# Altium schematic sheet schematic.SchDoc
size A4
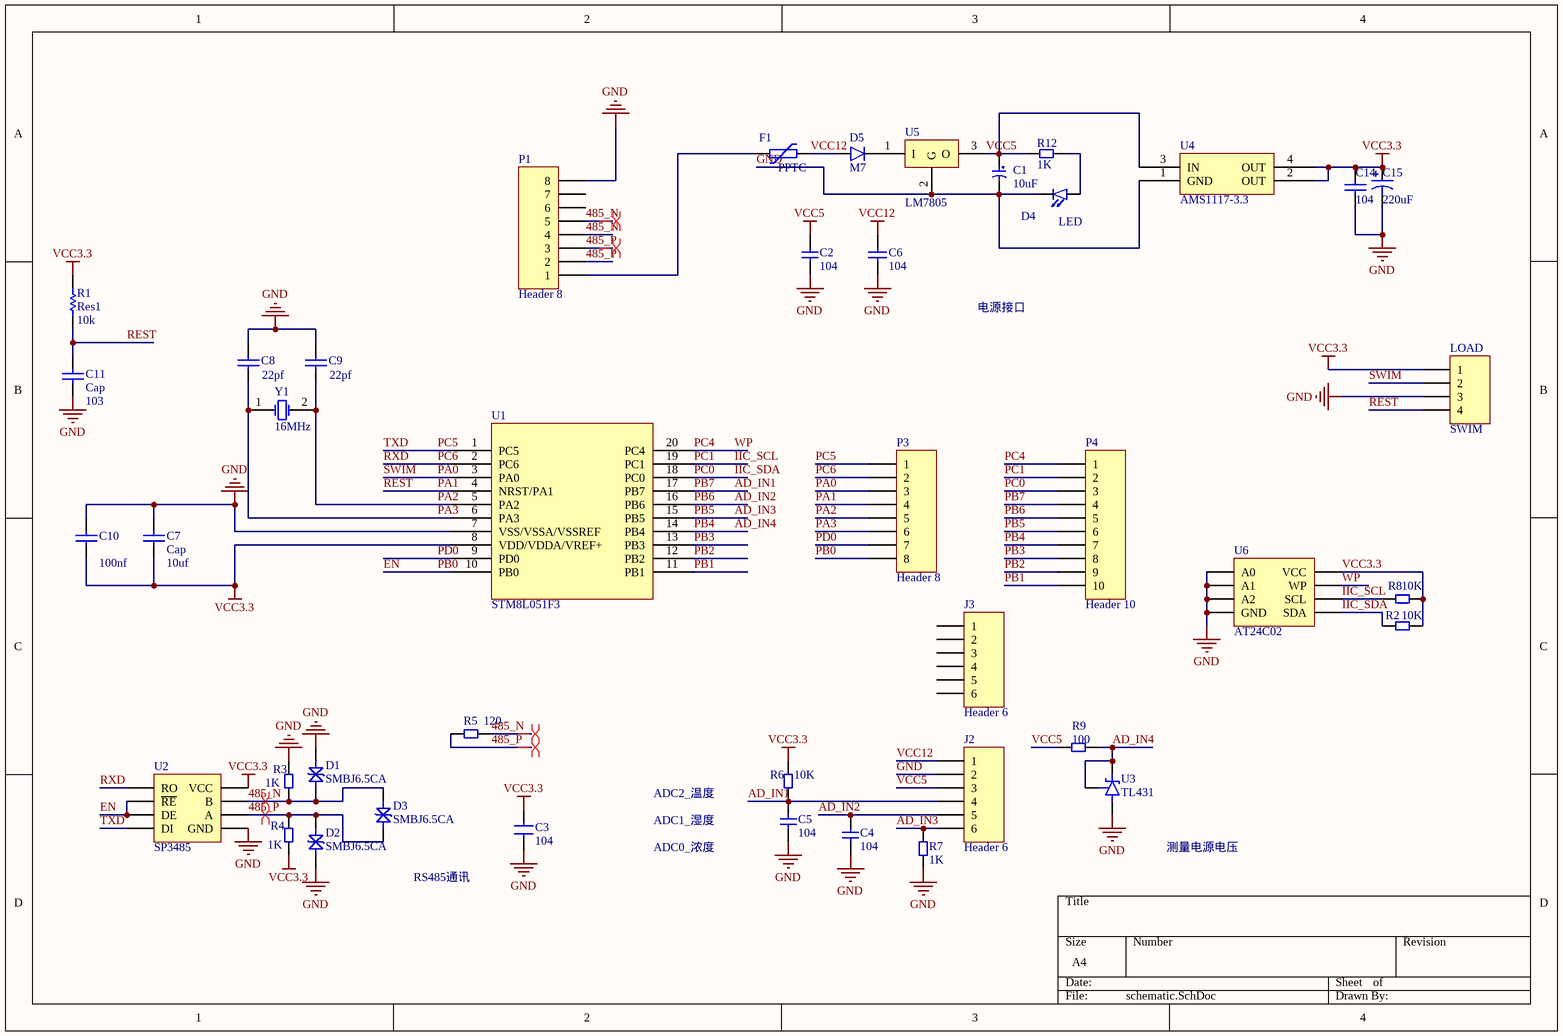
[diagram p0: schematic.SchDoc]

## Parts
C1  10uF  [1206-d]
C2  104  [0805]
C3  104  [0805]
C4  104  [0805]
C5  104  [0805]
C6  104  [0805C]
C7  Cap  value 10uf  [1206-D]
C8  value 22pf  [6-0805_N]  (hidden comment: Cap)
C9  value 22pf  [6-0805_N]  (hidden comment: Cap)
C10  value 100nf  [0805]  (hidden comment: Cap)
C11  Cap  value 103  [6-0805_N]
C14  value 104  [0805]  (hidden comment: Cap)
C15  value 220uF  [1206]  (hidden comment: Cap Pol1)
D1  SMBJ6.5CA  [smb do214aa]
D2  SMBJ6.5CA  [smb do214aa]
D3  SMBJ6.5CA  [smb do214aa]
D4  LED  [0805-D]
D5  M7  [SMA (DO-214AC)]
F1  PPTC  [1206]
J2  Header 6  [HDR1X6]
J3  Header 6  [HDR1X6]
LOAD  SWIM  [HDR1X4]
P1  Header 8  [RJ45]
P3  Header 8  [HDR1X8]
P4  Header 10  [HDR1X10]
R1  Res1  value 10k  [6-0805_N]
R2  10K  [0805]
R3  1K  [0805]
R4  1K  [0805]
R5  120  [0805]
R6  10K  [0805]
R7  1K  [0805]
R8  10K  [0805]
R9  100  [0805]
R12  1K  [0805]
U1  STM8L051F3  [SOP20]
U2  SP3485  [SOP8]
U3  TL431  [sot-23]
U4  AMS1117-3.3  [SOT-223]
U5  LM7805  [to-220]
U6  AT24C02  [sop8]
Y1  16MHz  [Y2]

## Nets
GND: C1.1 C2.1 C3.1 C4.1 C5.1 C6.1 C7.1 C8.2 C9.1 C10.2 C11.1 C14.1 C15.2 D1.1 D2.2 D4.2 J2.2 LOAD.3 P1.8 R3.2 R7.1 U1.7(VSS/VSSA/VSSREF) U2.5(GND) U3.3 U4.1(GND) U5.2(G) U6.1(A0) U6.2(A1) U6.3(A2) U6.4(GND)
VCC3.3: C3.2 C7.2 C10.1 C14.2 C15.1 LOAD.1 R1.2 R2.2 R4.1 R6.2 R8.2 U1.8(VDD/VDDA/VREF+) U2.8(VCC) U4.2(OUT) U4.4(OUT) U6.8(VCC)
VCC5: C1.2 C2.2 J2.3 R9.1 R12.1 U4.3(IN) U5.3(O)
VCC12: C6.2 D5.2(+) F1.2 J2.1
485_N: D1.2 D3.1 P1.4 P1.5 R3.1 R5.1 U2.7(B)
485_P: D2.1 D3.2 P1.2 P1.3 R4.2 R5.2 U2.6(A)
AD_IN1: C5.2 J2.4 P4.4 R6.1 U1.17(PB7)  [also labelled PB7]
AD_IN2: C4.2 J2.5 P4.5 U1.16(PB6)  [also labelled PB6]
AD_IN3: J2.6 P4.6 R7.2 U1.15(PB5)  [also labelled PB5]
AD_IN4: P4.7 R9.2 U1.14(PB4) U3.1 U3.2  [also labelled PB4]
EN: P3.8 U1.10(PB0) U2.2(~{RE}) U2.3(DE)  [also labelled PB0]
IIC_SCL: P4.2 R8.1 U1.19(PC1) U6.6(SCL)  [also labelled PC1]
IIC_SDA: P4.3 R2.1 U1.18(PC0) U6.5(SDA)  [also labelled PC0]
PA0: LOAD.2 P3.3 U1.3(PA0)  [also labelled SWIM]
PA1: C11.2 LOAD.4 P3.4 R1.1 U1.4(NRST/PA1)  [also labelled REST]
PA2: C9.2 P3.5 U1.5(PA2) Y1.2(OSC2)
PA3: C8.1 P3.6 U1.6(PA3) Y1.1(OSC1)
PB1: P4.10 U1.11(PB1)
PB2: P4.9 U1.12(PB2)
PB3: P4.8 U1.13(PB3)
PC4: P4.1 U1.20(PC4) U6.7(WP)  [also labelled WP]
PC5: P3.1 U1.1(PC5) U2.4(DI)  [also labelled TXD]
PC6: P3.2 U1.2(PC6) U2.1(RO)  [also labelled RXD]
PD0: P3.7 U1.9(PD0)
NetD4_1: D4.1 R12.2
NetD5_1: D5.1(-) U5.1(I)
NetF1_1: F1.1 P1.1

Not connected (* = marked no-connect by the designer): J3 1 2 3 4 5 6; P1 6 7

## Layout directives
differential pair: 485_N, 485_P

## Notes on the sheet
- 电源接口
- ADC2_温度
- ADC1_湿度
- ADC0_浓度
- 测量电源电压
- RS485通讯

## Library data of the parts
C1 = CAP-POL
C2 C4-C6 = CAP
C3 = Cap
C7-C11 C14 = Cap: Capacitor; Published: 8-Jun-2000; LatestRevisionDate: 17-Jul-2002; LatestRevisionNote: Re-released for DXP Platform.; PackageReference: RAD-0.3; Publisher: Altium Limited; PackageDescription: Radial Cap, Thru-Hole; 2 Leads; 0.3 in Pin Spacing
C15 = Cap Pol1: Polarized Capacitor (Radial); Published: 8-Jun-2000; LatestRevisionDate: 17-Jul-2002; LatestRevisionNote: Re-released for DXP Platform.; PackageReference: RB7.6-15; Publisher: Altium Limited; PackageDescription: Polarized Capacitor (Radial); 2 Leads
J2 J3 = Header 6: Header, 6-Pin; LatestRevisionDate: 17-Jul-2002; LatestRevisionNote: Re-released for DXP Platform.; Publisher: Altium Limited
LOAD = Header 4: Header, 4-Pin; LatestRevisionDate: 17-Jul-2002; LatestRevisionNote: Re-released for DXP Platform.; Publisher: Altium Limited
P1 P3 = Header 8: Header, 8-Pin; LatestRevisionDate: 17-Jul-2002; LatestRevisionNote: Re-released for DXP Platform.; Publisher: Altium Limited
P4 = Header 10: Header, 10-Pin; LatestRevisionDate: 17-Jul-2002; LatestRevisionNote: Re-released for DXP Platform.; Publisher: Altium Limited
R1 = Res1: Resistor; Published: 8-Jun-2000; LatestRevisionDate: 17-Jul-2002; LatestRevisionNote: Re-released for DXP Platform.; PackageReference: AXIAL-0.3; Publisher: Altium Limited; PackageDescription: Axial Device, Thru-Hole; 2 Leads; 0.3 in Pin Spacing
R2-R9 R12 = Res
Y1 = XTAL: Crystal Oscillator; Published: 8-Jun-2000; LatestRevisionDate: 17-Jul-2002; LatestRevisionNote: Re-released for DXP Platform.; PackageReference: R38; Publisher: Altium Limited; PackageDescription: Crystal, Thru-Hole; 2 Leads; Body 3.1 x 8.2 mm (Dia.xH)